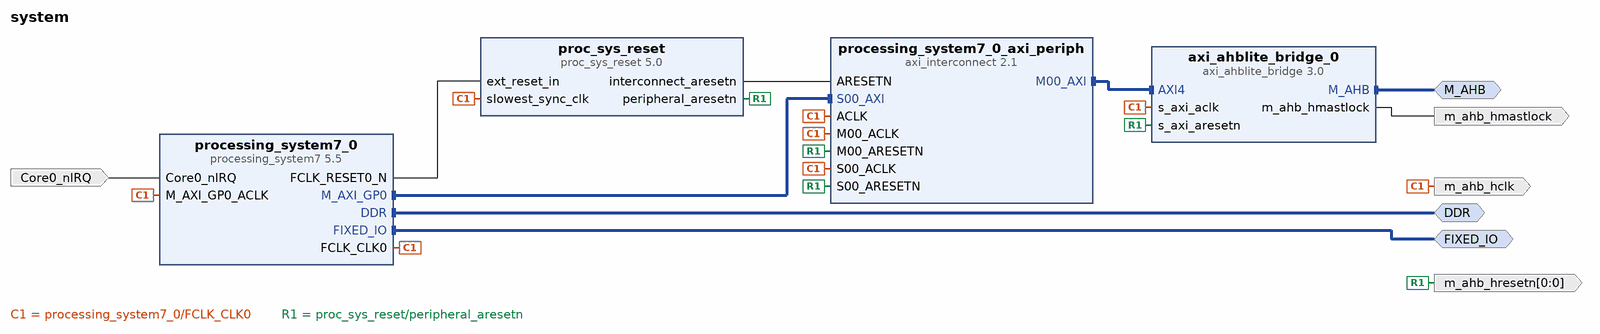
[diagram p0: block diagram of the top level]
# Vivado block design system, Vivado 2014.4_63036
create_bd_design system

create_bd_intf_port -mode Master -vlnv xilinx.com:interface:ddrx_rtl:1.0 DDR
create_bd_intf_port -mode Master -vlnv xilinx.com:display_processing_system7:fixedio_rtl:1.0 FIXED_IO
create_bd_intf_port -mode Master -vlnv xilinx.com:interface:ahblite_rtl:1.0 M_AHB
create_bd_port -dir O -type clk m_ahb_hclk
create_bd_port -dir O -from 0 -to 0 -type rst m_ahb_hresetn
create_bd_port -dir I -type intr Core0_nIRQ
create_bd_port -dir O m_ahb_hmastlock

create_bd_cell -type ip -vlnv xilinx.com:ip:axi_ahblite_bridge:3.0 axi_ahblite_bridge_0
create_bd_cell -type ip -vlnv xilinx.com:ip:proc_sys_reset:5.0 proc_sys_reset
create_bd_cell -type ip -vlnv xilinx.com:ip:processing_system7:5.5 processing_system7_0
set_property -dict [list \
  CONFIG.PCW_USE_FABRIC_INTERRUPT 1 \
  CONFIG.PCW_CORE0_IRQ_INTR 1 \
  CONFIG.PCW_UIPARAM_DDR_PARTNO {MT41J256M16 RE-125} \
  CONFIG.PCW_UART1_PERIPHERAL_ENABLE 1 \
] [get_bd_cells processing_system7_0]
# 13 more settings of processing_system7_0 are not shown: defaults, MIO pin electricals, DDR timing, and values the tool derives
create_bd_cell -type ip -vlnv xilinx.com:ip:axi_interconnect:2.1 processing_system7_0_axi_periph
set_property -dict {CONFIG.NUM_MI 1} [get_bd_cells processing_system7_0_axi_periph]

# ---- connections ----

connect_bd_intf_net [get_bd_intf_pins processing_system7_0/M_AXI_GP0] [get_bd_intf_pins processing_system7_0_axi_periph/S00_AXI]
connect_bd_intf_net [get_bd_intf_pins processing_system7_0_axi_periph/M00_AXI] [get_bd_intf_pins axi_ahblite_bridge_0/AXI4]
connect_bd_intf_net [get_bd_intf_ports DDR] [get_bd_intf_pins processing_system7_0/DDR]
connect_bd_intf_net [get_bd_intf_ports FIXED_IO] [get_bd_intf_pins processing_system7_0/FIXED_IO]
connect_bd_intf_net [get_bd_intf_ports M_AHB] [get_bd_intf_pins axi_ahblite_bridge_0/M_AHB]
connect_bd_net [get_bd_pins processing_system7_0/FCLK_CLK0] \
  [get_bd_ports m_ahb_hclk] [get_bd_pins axi_ahblite_bridge_0/s_axi_aclk] [get_bd_pins proc_sys_reset/slowest_sync_clk] \
  [get_bd_pins processing_system7_0/M_AXI_GP0_ACLK] [get_bd_pins processing_system7_0_axi_periph/ACLK] \
  [get_bd_pins processing_system7_0_axi_periph/S00_ACLK] [get_bd_pins processing_system7_0_axi_periph/M00_ACLK]
connect_bd_net [get_bd_pins processing_system7_0/FCLK_RESET0_N] [get_bd_pins proc_sys_reset/ext_reset_in]
connect_bd_net [get_bd_pins proc_sys_reset/peripheral_aresetn] \
  [get_bd_ports m_ahb_hresetn] [get_bd_pins axi_ahblite_bridge_0/s_axi_aresetn] \
  [get_bd_pins processing_system7_0_axi_periph/S00_ARESETN] [get_bd_pins processing_system7_0_axi_periph/M00_ARESETN]
connect_bd_net [get_bd_pins proc_sys_reset/interconnect_aresetn] [get_bd_pins processing_system7_0_axi_periph/ARESETN]
connect_bd_net [get_bd_ports Core0_nIRQ] [get_bd_pins processing_system7_0/Core0_nIRQ]
connect_bd_net [get_bd_pins axi_ahblite_bridge_0/m_ahb_hmastlock] [get_bd_ports m_ahb_hmastlock]

# ---- address map ----
assign_bd_address -offset 0x43C00000 -range 64K -target_address_space [get_bd_addr_spaces processing_system7_0/Data] [get_bd_addr_segs M_AHB/Reg]

validate_bd_design
save_bd_design
